# Altium project SistemaMinimo-dsPIC33FJ64MC804.PrjPcb
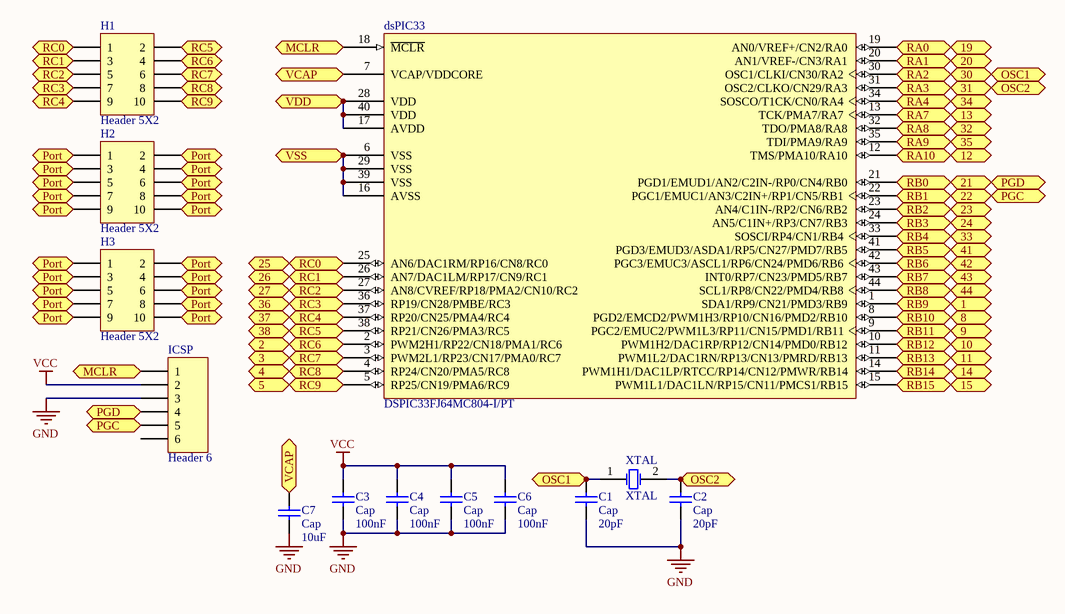
[diagram p0: SistemaMinimo-dsPIC33FJ64MC804.SchDoc]
1 sheet, 13 parts. Net scope: flat (ports and power ports of the same name join across sheets).
Board file: SistemaMinimo-dsPIC33FJ64MC804.PcbDoc

## Sheet SistemaMinimo-dsPIC33FJ64MC804.SchDoc
size A4

### Parts
C1  Cap  value 20pF  [RAD-0.3]
C2  Cap  value 20pF  [RAD-0.3]
C3  Cap  value 100nF  [RAD-0.3]
C4  Cap  value 100nF  [RAD-0.3]
C5  Cap  value 100nF  [RAD-0.3]
C6  Cap  value 100nF  [RAD-0.3]
C7  Cap  value 10uF  [RAD-0.3]
dsPIC33  DSPIC33FJ64MC804-I/PT  [TQFP-PT44_N]
H1  Header 5X2  [HDR2X5]
H2  Header 5X2  [HDR2X5]
H3  Header 5X2  [HDR2X5]
ICSP  Header 6  [HDR1X6]
XTAL  XTAL  [R38]

### Ports
1, 2, 3, 4, 5, 8, 9, 10, 11, 12, 13, 14, 15, 19, 20, 21, 22, 23, 24, 25, 26, 27, 30, 31, 32, 33, 34, 35, 36, 37, 38, 41, 42, 43, 44, MCLR, OSC1, OSC2, PGC, PGD, Port, RA0, RA1, RA2, RA3, RA4, RA7, RA8, RA9, RA10, RB0, RB1, RB2, RB3, RB4, RB5, RB6, RB7, RB8, RB9, RB10, RB11, RB12, RB13, RB14, RB15, RC0, RC1, RC2, RC3, RC4, RC5, RC6, RC7, RC8, RC9, VCAP, VDD, VSS

### Nets
GND: C1.1 C2.1 C3.1 C4.1 C5.1 C6.1 C7.1 ICSP.3
VCC: C3.2 C4.2 C5.2 C6.2 ICSP.2
NetC1_2: C1.2 dsPIC33.30(OSC1/CLKI/CN30/RA2) XTAL.1(OSC1) ; port RA2, port 30, port OSC1
NetC2_2: C2.2 dsPIC33.31(OSC2/CLKO/CN29/RA3) XTAL.2(OSC2) ; port RA3, port 31, port OSC2
NetC7_2: C7.2 dsPIC33.7(VCAP/VDDCORE) ; port VCAP
NetdsPIC33_1: dsPIC33.1(SDA1/RP9/CN21/PMD3/RB9) ; port RB9, port 1
NetdsPIC33_2: dsPIC33.2(PWM2H1/RP22/CN18/PMA1/RC6) H1.4 ; port RC6, port 2
NetdsPIC33_3: dsPIC33.3(PWM2L1/RP23/CN17/PMA0/RC7) H1.6 ; port RC7, port 3
NetdsPIC33_4: dsPIC33.4(RP24/CN20/PMA5/RC8) H1.8 ; port RC8, port 4
NetdsPIC33_5: dsPIC33.5(RP25/CN19/PMA6/RC9) H1.10 ; port RC9, port 5
NetdsPIC33_6: dsPIC33.6(VSS) dsPIC33.16(AVSS) dsPIC33.29(VSS) dsPIC33.39(VSS) ; port VSS
NetdsPIC33_8: dsPIC33.8(PGD2/EMCD2/PWM1H3/RP10/CN16/PMD2/RB10) ; port RB10, port 8
NetdsPIC33_9: dsPIC33.9(PGC2/EMUC2/PWM1L3/RP11/CN15/PMD1/RB11) ; port RB11, port 9
NetdsPIC33_10: dsPIC33.10(PWM1H2/DAC1RP/RP12/CN14/PMD0/RB12) ; port RB12, port 10
NetdsPIC33_11: dsPIC33.11(PWM1L2/DAC1RN/RP13/CN13/PMRD/RB13) ; port RB13, port 11
NetdsPIC33_12: dsPIC33.12(TMS/PMA10/RA10) ; port RA10, port 12
NetdsPIC33_13: dsPIC33.13(TCK/PMA7/RA7) ; port RA7, port 13
NetdsPIC33_14: dsPIC33.14(PWM1H1/DAC1LP/RTCC/RP14/CN12/PMWR/RB14) ; port RB14, port 14
NetdsPIC33_15: dsPIC33.15(PWM1L1/DAC1LN/RP15/CN11/PMCS1/RB15) ; port RB15, port 15
NetdsPIC33_17: dsPIC33.17(AVDD) dsPIC33.28(VDD) dsPIC33.40(VDD) ; port VDD
NetdsPIC33_18: dsPIC33.18(~{MCLR}) ICSP.1 ; port MCLR
NetdsPIC33_19: dsPIC33.19(AN0/VREF+/CN2/RA0) ; port RA0, port 19
NetdsPIC33_20: dsPIC33.20(AN1/VREF-/CN3/RA1) ; port RA1, port 20
NetdsPIC33_21: dsPIC33.21(PGD1/EMUD1/AN2/C2IN-/RP0/CN4/RB0) ICSP.4 ; port RB0, port 21, port PGD
NetdsPIC33_22: dsPIC33.22(PGC1/EMUC1/AN3/C2IN+/RP1/CN5/RB1) ICSP.5 ; port RB1, port 22, port PGC
NetdsPIC33_23: dsPIC33.23(AN4/C1IN-/RP2/CN6/RB2) ; port RB2, port 23
NetdsPIC33_24: dsPIC33.24(AN5/C1IN+/RP3/CN7/RB3) ; port RB3, port 24
NetdsPIC33_25: dsPIC33.25(AN6/DAC1RM/RP16/CN8/RC0) H1.1 ; port RC0, port 25
NetdsPIC33_26: dsPIC33.26(AN7/DAC1LM/RP17/CN9/RC1) H1.3 ; port RC1, port 26
NetdsPIC33_27: dsPIC33.27(AN8/CVREF/RP18/PMA2/CN10/RC2) H1.5 ; port RC2, port 27
NetdsPIC33_32: dsPIC33.32(TDO/PMA8/RA8) ; port RA8, port 32
NetdsPIC33_33: dsPIC33.33(SOSCI/RP4/CN1/RB4) ; port RB4, port 33
NetdsPIC33_34: dsPIC33.34(SOSCO/T1CK/CN0/RA4) ; port RA4, port 34
NetdsPIC33_35: dsPIC33.35(TDI/PMA9/RA9) ; port RA9, port 35
NetdsPIC33_36: dsPIC33.36(RP19/CN28/PMBE/RC3) H1.7 ; port RC3, port 36
NetdsPIC33_37: dsPIC33.37(RP20/CN25/PMA4/RC4) H1.9 ; port RC4, port 37
NetdsPIC33_38: dsPIC33.38(RP21/CN26/PMA3/RC5) H1.2 ; port RC5, port 38
NetdsPIC33_41: dsPIC33.41(PGD3/EMUD3/ASDA1/RP5/CN27/PMD7/RB5) ; port RB5, port 41
NetdsPIC33_42: dsPIC33.42(PGC3/EMUC3/ASCL1/RP6/CN24/PMD6/RB6) ; port RB6, port 42
NetdsPIC33_43: dsPIC33.43(INT0/RP7/CN23/PMD5/RB7) ; port RB7, port 43
NetdsPIC33_44: dsPIC33.44(SCL1/RP8/CN22/PMD4/RB8) ; port RB8, port 44
NetH2_1: H2.1 H2.2 H2.3 H2.4 H2.5 H2.6 H2.7 H2.8 H2.9 H2.10 H3.1 H3.2 H3.3 H3.4 H3.5 H3.6 H3.7 H3.8 H3.9 H3.10 ; port Port

Not connected (* = marked no-connect by the designer): ICSP 6

### Library data of the parts
C1-C7 = Cap: Capacitor; Published: 8-Jun-2000; LatestRevisionDate: 17-Jul-2002; LatestRevisionNote: Re-released for DXP Platform.; PackageReference: RAD-0.3; Publisher: Altium Limited; PackageDescription: Radial Cap, Thru-Hole; 2 Leads; 0.3 in Pin Spacing
dsPIC33 = DSPIC33FJ64MC804-I/PT: High-Performance 16-bit Digital Signal Controller, 64 KB Flash, 16 KB RAM, 44-Pin TQFP, Industrial Temperature; Published: 2-Dec-2009; DatasheetVersion: revD, Nov-2009; PackageVersion: revBB, Aug-2009; PackageReference: TQFP-PT44; Publisher: Altium Limited; PackageDescription: 44-Lead Plastic Thin Quad Flatpack (PT) - 10x10x1mm Body, 2.00mm [TQFP]; Supplier 1: Digi-Key; Supplier Part Number 1: DSPIC33FJ64MC804-I/PT-ND; Supplier 2: Farnell; Supplier Part Number 2: 1576844; Code_JEDEC: MS-026; ComponentLink1Description: Datasheet; ComponentLink1URL: http://ww1.microchip.com/downloads/en/DeviceDoc/70291D.pdf; ComponentLink2Description: Packaging Specification; ComponentLink2URL: http://www.microchip.com/stellent/groups/techpub_sg/documents/packagingspec/en012702.pdf; ComponentLink3Description: Microchip.com Home; ComponentLink3URL: http://www.microchip.com/
H1-H3 = Header 5X2: Header, 5-Pin, Dual row; LatestRevisionDate: 17-Jul-2002; LatestRevisionNote: Re-released for DXP Platform.; Publisher: Altium Limited
ICSP = Header 6: Header, 6-Pin; LatestRevisionDate: 17-Jul-2002; LatestRevisionNote: Re-released for DXP Platform.; Publisher: Altium Limited
XTAL = XTAL: Crystal Oscillator; Published: 8-Jun-2000; LatestRevisionDate: 17-Jul-2002; LatestRevisionNote: Re-released for DXP Platform.; PackageReference: R38; Publisher: Altium Limited; PackageDescription: Crystal, Thru-Hole; 2 Leads; Body 3.1 x 8.2 mm (Dia.xH)